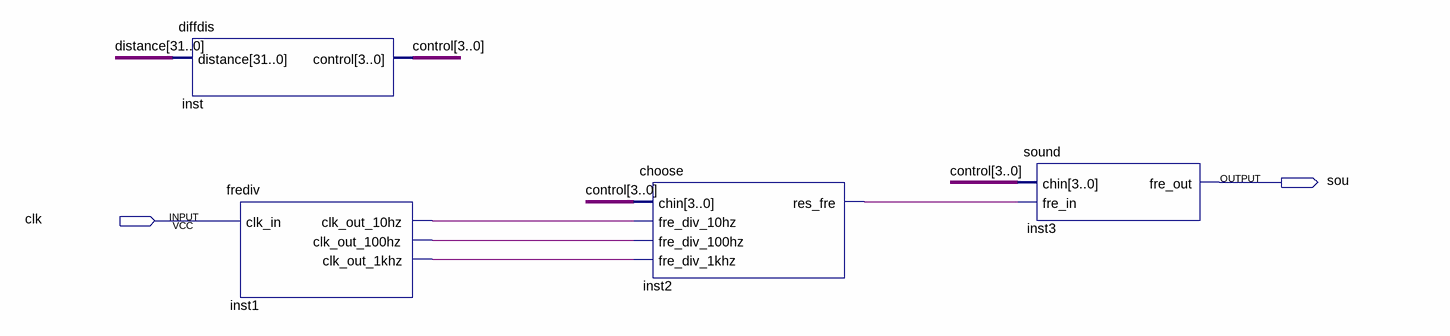
[diagram p0: schematic sheet]
// Quartus schematic soundM.bdf as structural Verilog: 4 symbols, 2 pins
module soundM (
  input  clk,
  output sou
);

  wire inst1_clk_out_1khz, inst1_clk_out_10hz, inst1_clk_out_100hz, inst2_res_fre;
  wire [3:0] control;
  wire [31:0] distance;

  diffdis inst (.distance(distance), .control(control));
  frediv inst1 (
    .clk_in(clk), .clk_out_10hz(inst1_clk_out_10hz), .clk_out_100hz(inst1_clk_out_100hz),
    .clk_out_1khz(inst1_clk_out_1khz));
  choose inst2 (
    .chin(control), .fre_div_10hz(inst1_clk_out_10hz), .fre_div_100hz(inst1_clk_out_100hz),
    .fre_div_1khz(inst1_clk_out_1khz), .res_fre(inst2_res_fre));
  sound inst3 (.chin(control), .fre_in(inst2_res_fre), .fre_out(sou));
endmodule
